# Altium schematic sheet CPU_LPC1776_SUP_PROG.SchDoc: Metlino
size 420 x 297 mm; CheckedBy: P.Kulik,T.Przywozki,W.Ruclo; Author: G.Kasprowicz; CompanyName: WUT ISE; DrawnBy: G.Kasprowicz; Organization: WUT ISE; Address1: PW ISE; Address2: Nowowiejska 15/19 00-665 Warsaw; Address3: gkasprow@gmail.com; DocumentNumber: 27; Revision: 2; SheetNumber: 27; SheetTotal: 29; ModifiedBy: -; CheckedDate: -; Title2: MMC - power & JTAG; DivGrp: WUT ISE; Designer: G.Kasprowicz; ModifiedDate: -; ProjectName: Sensor Box
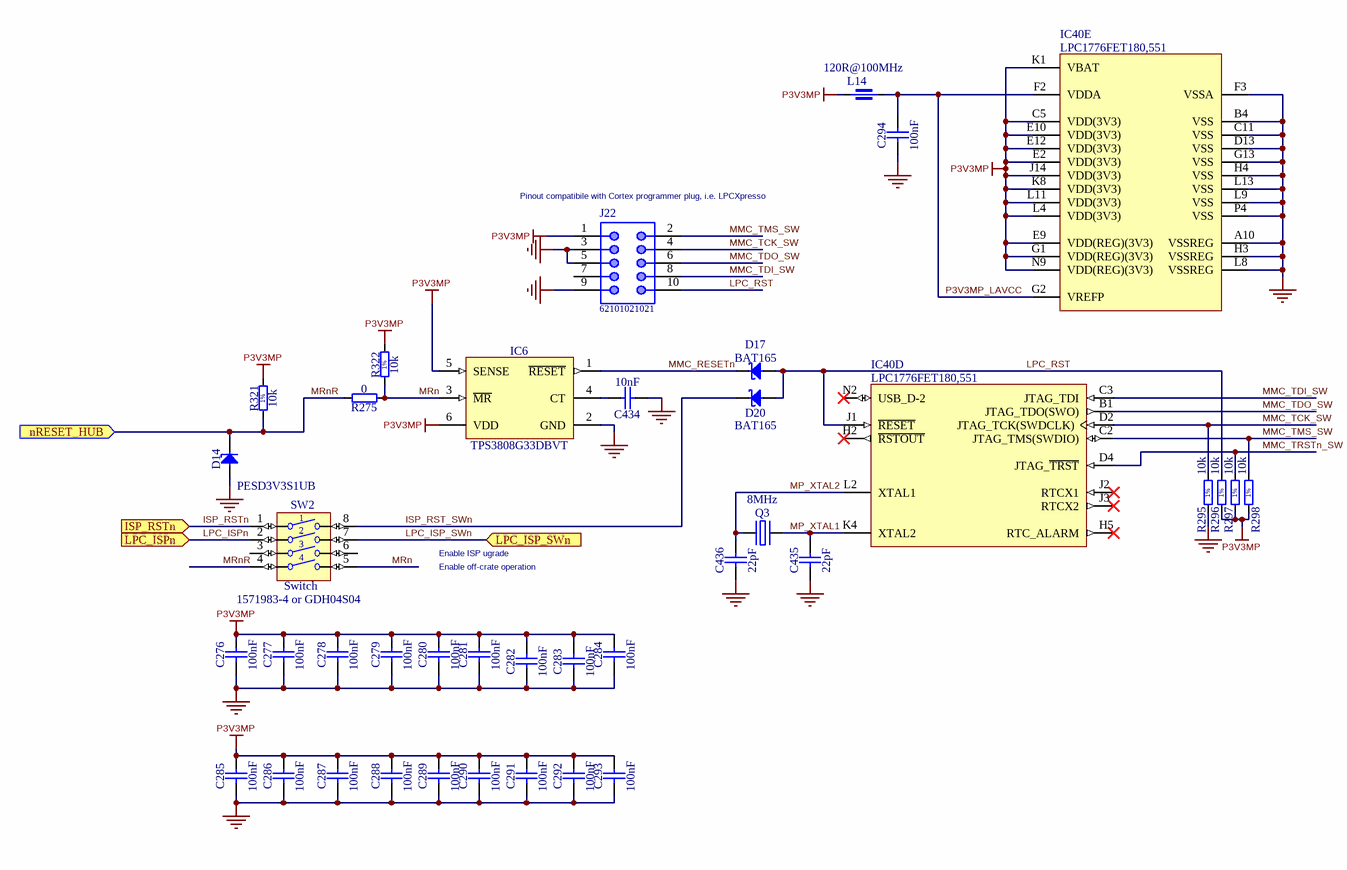
[diagram p0: CPU_LPC1776_SUP_PROG.SchDoc]

## Parts
C276  100nF  [CAPC0603X33N]
C277  100nF  [CAPC0603X33N]
C278  100nF  [CAPC0603X33N]
C279  100nF  [CAPC0603X33N]
C280  100nF  [CAPC0603X33N]
C281  100nF  [CAPC0603X33N]
C282  100nF  [CAPC0603X33N]
C283  100nF  [CAPC0603X33N]
C284  100nF  [CAPC0603X33N]
C285  100nF  [CAPC0603X33N]
C286  100nF  [CAPC0603X33N]
C287  100nF  [CAPC0603X33N]
C288  100nF  [CAPC0603X33N]
C289  100nF  [CAPC0603X33N]
C290  100nF  [CAPC0603X33N]
C291  100nF  [CAPC0603X33N]
C292  100nF  [CAPC0603X33N]
C293  100nF  [CAPC0603X33N]
C294  100nF  [CAPC0603X33N]
C434  10nF  [CAPC1005X55N]
C435  22pF  [CAPC1005X55N]
C436  22pF  [CAPC1005X55N]
D14  PESD3V3S1UB  [SODFL1608X65N]
D17  BAT165  [SOD2512X110N]
D20  BAT165  [SOD2512X110N]
IC6  TPS3808G33DBVT  [SOT95P280X145-6N]
IC40  LPC1776FET180,551  [BGA180C80P14X14_1200X1200X120]  (parts D,E of 5)
J22  62101021021  [62101021021]
L14  120R@100MHz  [INDC1608X95N]
Q3  8MHz  [XTAL_TXC_7A]
R275  0  [RESC1005X40N]
R295  10k  [RESC1005X40N]
R296  10k  [RESC1005X40N]
R297  10k  [RESC1005X40N]
R298  10k  [RESC1005X40N]
R321  10k  [RESC1005X40N]
R322  10k  [RESC1005X40N]
SW2  Switch  Manufacturer Part Number: 1571983-4 or GDH04S04  [SW_TYCO_1571983-4]

## Ports
ISP_RSTn (in), LPC_ISP_SWn (in), LPC_ISPn (in), nRESET_HUB (in)

## Nets
GND: C276.2 C277.2 C278.2 C279.2 C280.2 C281.2 C282.2 C283.2 C284.2 C285.2 C286.2 C287.2 C288.2 C289.2 C290.2 C291.2 C292.2 C293.2 C294.2 C434.1 C435.1 C436.1 D14.2(A) IC6.2(GND) IC40.A10(VSSREG) IC40.B4(VSS) IC40.C11(VSS) IC40.D13(VSS) IC40.F3(VSSA) IC40.G13(VSS) IC40.H3(VSSREG) IC40.H4(VSS) IC40.L8(VSSREG) IC40.L9(VSS) IC40.L13(VSS) IC40.P4(VSS) J22.3 J22.5 J22.9 R295.1
P3V3MP: C276.1 C277.1 C278.1 C279.1 C280.1 C281.1 C282.1 C283.1 C284.1 C285.1 C286.1 C287.1 C288.1 C289.1 C290.1 C291.1 C292.1 C293.1 IC6.5(SENSE) IC6.6(VDD) IC40.C5(VDD(3V3)) IC40.E2(VDD(3V3)) IC40.E9(VDD(REG)(3V3)) IC40.E10(VDD(3V3)) IC40.E12(VDD(3V3)) IC40.G1(VDD(REG)(3V3)) IC40.J14(VDD(3V3)) IC40.K1(VBAT) IC40.K8(VDD(3V3)) IC40.L4(VDD(3V3)) IC40.L11(VDD(3V3)) IC40.N9(VDD(REG)(3V3)) J22.1 L14.2 R296.1 R297.1 R298.1 R321.2 R322.2
ISP_RST_SWn: D20.1(C) SW2.8
ISP_RSTn: SW2.1 ; port ISP_RSTn
LPC_ISP_SWn: SW2.7 ; port LPC_ISP_SWn
LPC_ISPn: SW2.2 ; port LPC_ISPn
LPC_RST: D17.2(A) D20.2(A) IC40.J1(~{RESET}) J22.10 R296.2
MMC_RESETn: D17.1(C) IC6.1(~{RESET})
MMC_TCK_SW: IC40.D2(JTAG_TCK(SWDCLK)) J22.4 R295.2
MMC_TDI_SW: IC40.C3(JTAG_TDI) J22.8
MMC_TDO_SW: IC40.B1(JTAG_TDO(SWO)) J22.6
MMC_TMS_SW: IC40.C2(JTAG_TMS(SWDIO)) J22.2 R298.2
MMC_TRSTn_SW: IC40.D4(JTAG_~{TRST}) R297.2
MP_XTAL1: C435.2 IC40.K4(XTAL2) Q3.2(OSC2)
MP_XTAL2: C436.2 IC40.L2(XTAL1) Q3.1(OSC1)
MRn: IC6.3(~{MR}) R275.1 R322.1 SW2.5
MRnR: D14.1(C) R275.2 R321.1 SW2.4 ; port nRESET_HUB
P3V3MP_LAVCC: C294.1 IC40.F2(VDDA) IC40.G2(VREFP) L14.1
NetC434_2: C434.2 IC6.4(CT)

Not connected (* = marked no-connect by the designer): IC40 H2(~{RSTOUT})* H5(RTC_ALARM)* J2(RTCX1)* J3(RTCX2)* N2(USB_D-2)*; J22 7; SW2 3 6

## Notes on the sheet
- (near J22) Pinout compatibile with Cortex programmer plug, i.e. LPCXpresso
- Enable ISP ugrade
- Enable off-crate operation
- Project/Equipment
- Document
- Designer
- Drawn by
- Check.by
- Copyright WUT ISE 2018.
  This documentation describes Open Hardware and is licensed under the CERN OHL v.1.1. You may redistribute and modify this documentation under the terms of the CERN OHL v.1.1. (http://ohwr.org/CERNOHL). This documentation is distributed WITHOUT ANY EXPRESS OR IMPLIED WARRANTY, INCLUDING OF MERCHANTABILITY, SATISFACTORY QUALITY AND FITNESS FOR A PARTICULAR PURPOSE. Please see the CERN OHL v.1.1 for applicable conditions.
- Contact
- File
- Last Mod.
- Print Date
- Sheet
- Size
- A3
- of
- Rev
- (in symbol R0402_10K_1%_0.0625W_100PPM) 1%

## Library data of the parts
C276-C294 = CC0201_100NF_6.3V_10%_X5R: Non-polarised capacitor; Manufacturer: GENERIC; Part Description: SMD Multilayer Chip Ceramic Capacitor; Manufacturer1 Part Number: 02016D104KAT2A; Tolerance: ±10%; Voltage: 6.3V; TC: X5R; Manufacturer Part Number: CC0201_100NF_6.3V_10%_X5R; Part Number: CC0201_100NF_6.3V_10%_X5R; Value: 100nF; Component Kind: Standard; Component Type: Standard; Pin Count: 2; Status: Not Recommended; Case: 0201; Mounted: Yes; Socket: No; SMD: Yes; Sense: No; Manufacturer1 Example: AVX; Manufacturer1 ComponentHeight: 0.33mm; HelpURL: \\cern.ch\dfs\Applications\Altium\Datasheets\CC0201_X5R_AVX.pdf; Author: CERN DEM JLC; CreateDate: 03.12.2007; LatestRevisionDate: 03.12.2007
C434 = CC0402_10NF_16V_10%_X7R: Non-polarised capacitor; Manufacturer: GENERIC; Part Description: SMD Multilayer Chip Ceramic Capacitor; Manufacturer1 Part Number: 223878715636; Tolerance: ±10%; Voltage: 16V; TC: X7R; Manufacturer Part Number: CC0402_10NF_16V_10%_X7R; Part Number: CC0402_10NF_16V_10%_X7R; Value: 10nF; Component Kind: Standard; Component Type: Standard; Pin Count: 2; Status: Not Recommended; Case: 0402; Mounted: Yes; Socket: No; SMD: Yes; Sense: No; Manufacturer1 Example: PHYCOMP; Manufacturer1 ComponentHeight: 0.55mm; HelpURL: \\cern.ch\dfs\Applications\Altium\Datasheets\CC0402_X7R_PHYCOMP.pdf; Author: CERN DEM JLC; CreateDate: 03.12.2007; LatestRevisionDate: 03.12.2007
C435 C436 = CC0402_22PF_50V_5%_C0G: Non-polarised capacitor; Manufacturer: GENERIC; Part Description: SMD Multilayer Chip Ceramic Capacitor; Manufacturer1 Part Number: C0402C220J5GACTU; Tolerance: ±5%; Voltage: 50V; TC: C0G/NP0; Manufacturer Part Number: CC0402_22PF_50V_5%_C0G; Part Number: CC0402_22PF_50V_5%_C0G; Value: 22pF; Component Kind: Standard; Component Type: Standard; Pin Count: 2; Status: Preferred; Case: 0402; Mounted: Yes; Socket: No; SMD: Yes; Sense: No; Manufacturer1 Example: KEMET; Manufacturer1 ComponentHeight: 0.55mm; HelpURL: \\cern.ch\dfs\Applications\Altium\Datasheets\CC0805_C0G_KEMET_(Commercial Grade).pdf; Author: CERN DEM JLC; CreateDate: 03.12.2007; LatestRevisionDate: 03.12.2007
D14 = PESD3V3S1UB: ESD protection diode; Manufacturer: NXP SEMICONDUCTORS; Part Description: ESD protection diode (23kV); Voltage: 3V3; Power: 330W; PressFit: No; Bonding: No; Manufacturer Part Number: PESD3V3S1UB; PackageDescription: Ultra Small Outline Diode Flat Lead (SOD-523), Body; 1.2mm L X 0.8mm W X 0.65mm H, IPC Medium Density; Part Number: PESD3V3S1UB; Component Kind: Standard; Component Type: Standard; Device: PESD3V3S1UB; Pin Count: 2; Case: SOD523; Mounted: Yes; Socket: No; SMD: Yes; Sense: No; ComponentHeight: 0.65mm; HelpURL: \\cern.ch\dfs\Applications\Altium\Datasheets\PESD3V3S1UB.pdf; Author: CERN DEM JLC; CreateDate: 29.11.2012; LatestRevisionDate: 29.11.2012
D17 D20 = BAT165: Schottky Diode; Manufacturer: INFINEON; Part Description: Medium Power AF Schottky Diode; Voltage: 40V; Power: 750mA; PressFit: No; Bonding: No; Manufacturer Part Number: BAT165; PackageDescription: Small Outline Diode (SOD-323), 1.70mm W X 1.25mm L X 1.10mm H body,  IPC Medium Density; Part Number: BAT165; Component Kind: Standard; Component Type: Standard; Device: BAT165; Pin Count: 2; Case: SOD323; Mounted: Yes; Socket: No; SMD: Yes; Sense: No; ComponentHeight: 1.1mm; HelpURL: \\cern.ch\dfs\Applications\Altium\Datasheets\BAT165.pdf; Author: CERN DEM JLC; CreateDate: 12.11.2014; LatestRevisionDate: 12.11.2014
IC6 = TPS3808G33DBVT: Low Quiescent Current, Programmable-Delay Supervisory Circuit; Manufacturer: TEXAS INSTRUMENTS; Part Description: 3.3V, Low Quiescent Current, Programmable-Delay Supervisory Circuit; PressFit: No; Bonding: No; Manufacturer Part Number: TPS3808G33DBVT; PackageDescription: SOT23, 6-Leads, Body 1.6x3.0mm, Pitch 0.95mm, IPC Medium Density; Part Number: TPS3808G33DBVT; Component Kind: Standard; Component Type: Standard; Device: TPS3808G33DBVT; Pin Count: 6; Case: SOT23-6; Mounted: Yes; Socket: No; SMD: Yes; Sense: No; ComponentHeight: 1.45mm; Author: CERN DEM JLC; HelpURL: \\cern.ch\dfs\Applications\Altium\Datasheets\TPS3808G33DBVT.pdf; CreateDate: 05.11.2013; LatestRevisionDate: 05.11.2013
IC40 = LPC1776FET180,551: 32-bit ARM Cortex-M3 MCU, 256kB Flash, 80kB SRAM, Ethernet, USB 2.0 Device/Host/OTG, CAN, 12-Bit ADC; Manufacturer: NXP SEMICONDUCTORS; Part Description: Cortex-M3, 32-bit ARM MCU, 256kB Flash, 80kB SRAM, Ethernet, USB 2.0 Device/Host/OTG, CAN, 12-Bit ADC; PressFit: No; Bonding: No; Manufacturer Part Number: LPC1776FET180,551; PackageDescription: BGA, 0.80mm Pitch, Square; 180 Pin, 14 Columns X 14 Rows, Body 12.00mm X 12.00mm X 1.20mm H, IPC Medium Density; Part Number: LPC1776FET180,551; Component Kind: Standard; Component Type: Standard; Device: LPC1776FET180,551; Pin Count: 180; Case: BGA180; Mounted: Yes; Socket: No; SMD: Yes; Sense: No; ComponentHeight: 1.2mm; HelpURL: \\cern.ch\dfs\Applications\Altium\Datasheets\LPC1776FET180,551.pdf; Author: CERN DEM JMW; CreateDate: 16.08.2016; LatestRevisionDate: 16.08.2016
J22 = 62101021021: SMT Vertical Pin Header WR-PHD, Pitch 1.27 mm, Dual Row, 10 pins; Pin Number: 10; Pitch: 1.27 mm; Gender: Male; Rated Current: 1 A; Working Voltage: 100 VAC; Withstanding Voltage: 500 VAC; Contact Resistance: 20 mOhm; ComponentLink1Description: Manufacturer; ComponentLink1URL: http://www.we-online.de; ComponentLink2Description: Datasheet; ComponentLink2URL: https://katalog.we-online.de/em/datasheet/62101021021.pdf; Part Number: 62101021021; Published Date: August 2018; Publisher: Wurth Elektronik; Operating Temperature: -40 to 105 degC; Mounting Technology: SMT; Packaging: Tube; Row Number: Dual; Orientation: Vertical
L14 = IND0603_MURATA_BLM18PG121SN1D: Manufacturer: MURATA; Part Description: SMD EMIFIL Chip Ferrite Bead; Power: 2A; Resistance: 0.05R; Manufacturer Part Number: BLM18PG121SN1D; Part Number: IND0603_MURATA_BLM18PG121SN1D; Value: 120R@100MHz; Component Kind: Standard; Component Type: Standard; Pin Count: 2; Status: None; Case: 0603; Mounted: Yes; Socket: No; SMD: Yes; Sense: No; ComponentHeight: 0.95mm; HelpURL: \\cern.ch\dfs\Applications\Altium\Datasheets\IND0603_MURATA_BLM18P.pdf; Author: CERN DEM BC; CreateDate: 27.07.2015; LatestRevisionDate: 25.10.2018
Q3 = XTAL_8MHZ_TXC_7A-8.000MAAE-T: Quartz Crystal; Manufacturer: TXC CORPORATION; Part Description: Tolerance: ±30ppm, Stability: ±30ppm, -20°C to +70°C, 12pF, SMD Glass Seam Sealing Crystal, 7A Series; PressFit: No; Bonding: No; Manufacturer Part Number: 7A-8.000MAAE-T; PackageDescription: 2 Pins, 3.2x5mm, SMD Glass Seam Sealing Crystal, 7A Serie; Part Number: XTAL_8MHZ_TXC_7A-8.000MAAE-T; Value: 8MHz; Component Kind: Standard; Component Type: Standard; Pin Count: 2; Mounted: Yes; Socket: No; SMD: Yes; Sense: No; ComponentHeight: 1.2mm; HelpURL: \\cern.ch\dfs\Applications\Altium\Datasheets\XTAL_TXC_7A.pdf; Author: CERN DEM JLC; CreateDate: 09.10.2014; LatestRevisionDate: 12.11.2014
R275 = R0402_0R_JUMPER: Resistor; Manufacturer: GENERIC; Part Description: 1A (0.05R Max DC Resistance) Zero Ohm Jumper; Manufacturer1 Part Number: 232270591001L; PressFit: No; Manufacturer Part Number: R0402_0R_JUMPER; Part Number: R0402_0R_JUMPER; Value: 0; Component Kind: Standard; Component Type: Standard; Pin Count: 2; Status: Not Recommended; Case: 0402; Mounted: Yes; Sense: No; Socket: No; SMD: Yes; Manufacturer1 Example: YAGEO PHYCOMP; Manufacturer1 ComponentHeight: 0.4mm; HelpURL: \\cern.ch\dfs\Applications\Altium\Datasheets\R0402_Phycomp_RC0402.pdf; Author: CERN DEM JLC; CreateDate: 03.12.2007; LatestRevisionDate: 17.10.2012
R295-R298 R321 R322 = R0402_10K_1%_0.0625W_100PPM: Resistor - 1%; Manufacturer: GENERIC; Part Description: General Purpose Thick Film Chip Resistor; Manufacturer1 Part Number: 232270671003L; TC: ±100ppm/°C; PressFit: No; Manufacturer Part Number: R0402_10K_1%_0.0625W_100PPM; Part Number: R0402_10K_1%_0.0625W_100PPM; Tolerance: ±1%; Value: 10k; Component Kind: Standard; Component Type: Standard; Pin Count: 2; Status: Not Recommended; Power: 0.0625W; Case: 0402; Mounted: Yes; Sense: No; Socket: No; SMD: Yes; Manufacturer1 Example: YAGEO PHYCOMP; Manufacturer1 ComponentHeight: 0.4mm; HelpURL: \\cern.ch\dfs\Applications\Altium\Datasheets\R0402_Phycomp_RC0402.pdf; Author: CERN DEM JLC; CreateDate: 03.12.2007; LatestRevisionDate: 17.10.2012
SW2 = SW_TYCO_1571983-4: 4 Ways SPST DIP Switch; Manufacturer: TYCO; Part Description: 4 Way SPST SMD DIP Switch, Latched, Contact Rating 0.025A 24VDC; PressFit: No; PackageDescription: Pitch 1.27mm,  Body 6.2x6.2mm, 4 Ways SPST Surface-Mount DIP Switch, TYCO GDH Series; Part Number: SW_TYCO_1571983-4; Component Kind: Standard; Component Type: Standard; Pin Count: 8; Family: Switch; Mounted: Yes; Socket: No; SMD: Yes; Sense: No; Status: None; ComponentHeight: 2.31mm; HelpURL: \\cern.ch\dfs\Applications\Altium\Datasheets\SW_TYCO_1571983-4.pdf; Author: CERN DEM JLC; CreateDate: 08.01.2009; LatestRevisionDate: 08.01.2009